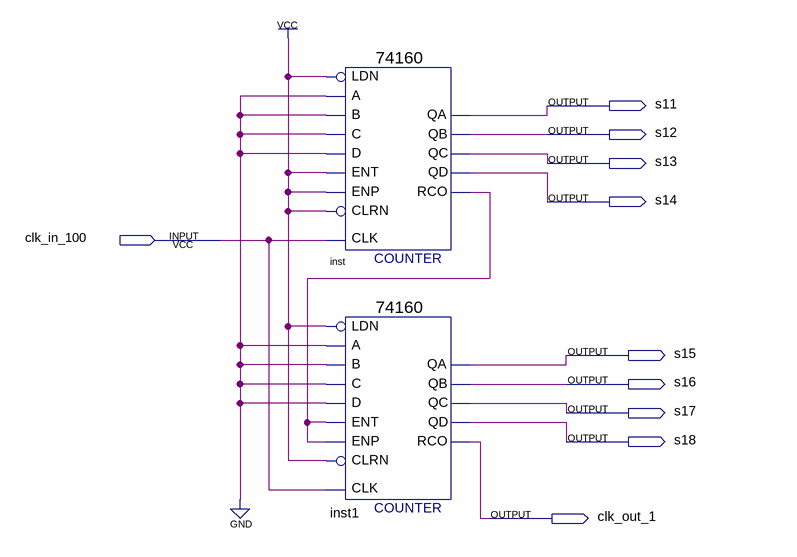
[diagram p0: schematic sheet]
// Quartus schematic cnt100plus.bdf as structural Verilog: 2 symbols, 10 pins
module cnt100plus (
  input  clk_in_100,
  output s11,
  output s12,
  output s13,
  output s14,
  output s15,
  output s16,
  output s17,
  output s18,
  output clk_out_1
);

  wire inst_rco;

  \74160  inst (
    .CLK(clk_in_100), .ENT(1'b1), .A(1'b0), .B(1'b0), .C(1'b0), .D(1'b0), .LDN(1'b1), .ENP(1'b1),
    .CLRN(1'b1), .QD(s14), .QA(s11), .QB(s12), .QC(s13), .RCO(inst_rco));
  \74160  inst1 (
    .CLK(clk_in_100), .ENT(inst_rco), .A(1'b0), .B(1'b0), .C(1'b0), .D(1'b0), .LDN(1'b1), .ENP(inst_rco),
    .CLRN(1'b1), .QD(s18), .QA(s15), .QB(s16), .QC(s17), .RCO(clk_out_1));
endmodule
